# Altium schematic sheet Структурная.SchDoc
size 840 x 594 mm; Address1: Address1; Address2: Address2; Address3: Address3; Address4: Address4; SheetNumber: 1; Scale: 1:1; Разраб.: Иванов; Обозначение документа: АБВГ.123456.001 Э3; Пров.: Петров; Утв.: Сидоров; Наименование организации: ОАО "Концерн "МПО-Гидроприбор"; Перв. применение: АБВГ.123456.000; Наименование изделия 1: Плата; Наименование изделия 2: Схема электрическая; Наименование изделия 3: принципиальная; Нач. отд.: Нач. отд.; Фамилия нач. отд.: Сидоров
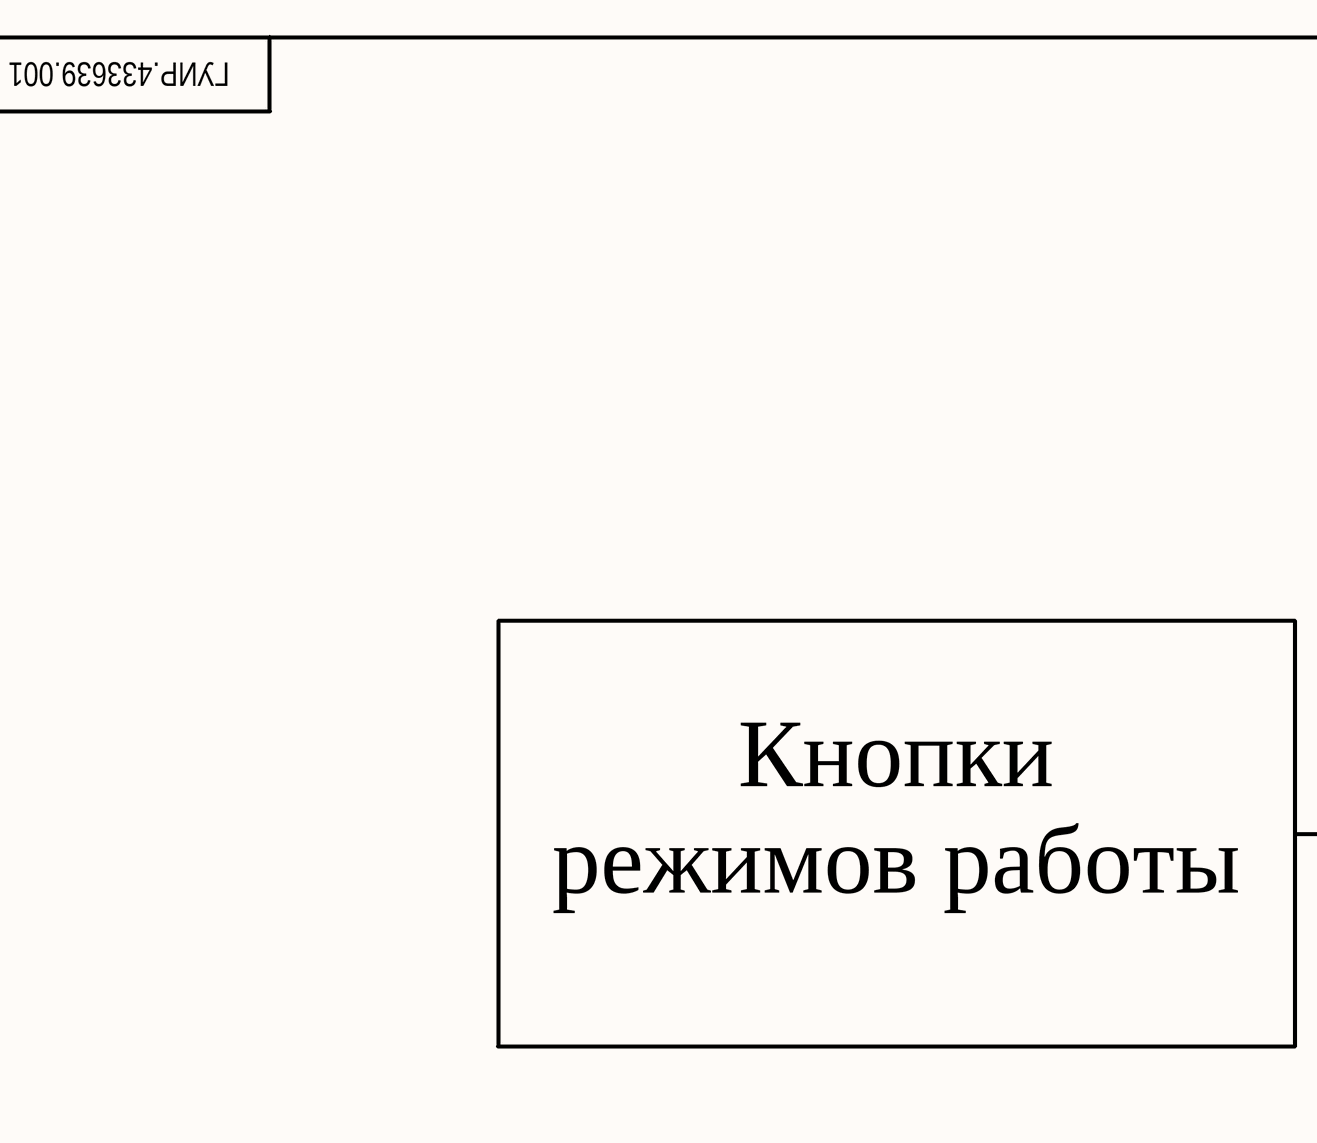
[diagram p0: Структурная.SchDoc, top left]
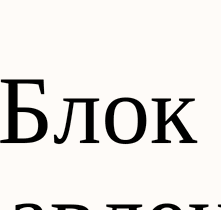
[diagram p1: Структурная.SchDoc, top middle]
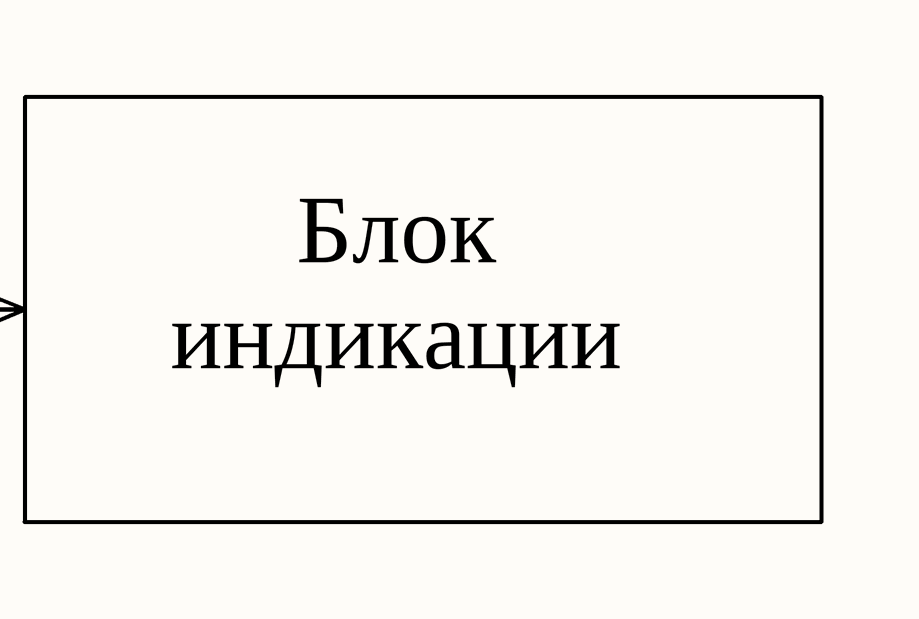
[diagram p2: Структурная.SchDoc, top right]
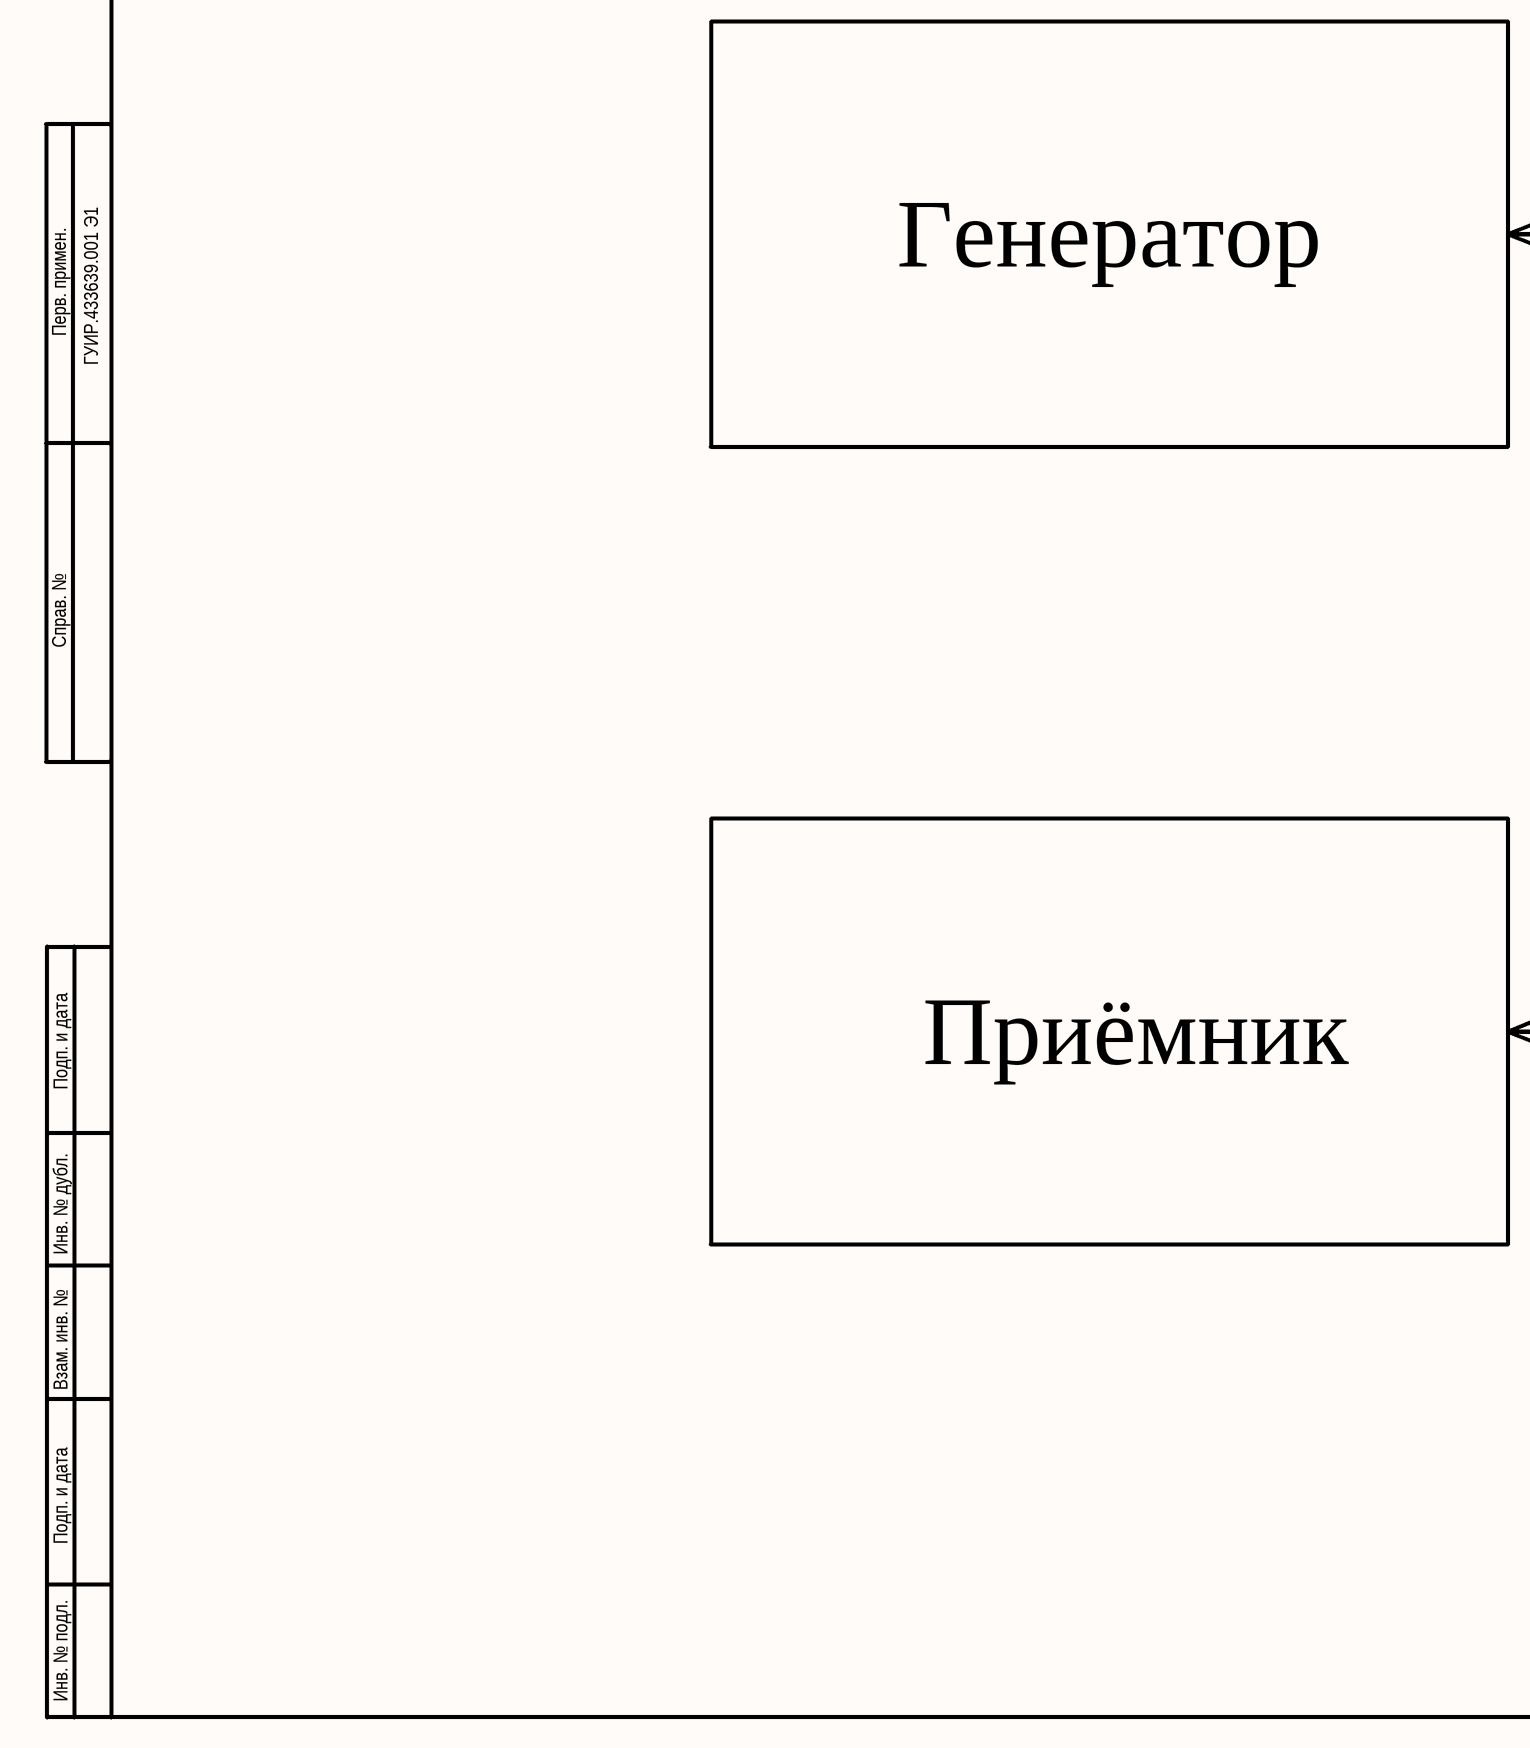
[diagram p3: Структурная.SchDoc, bottom left]
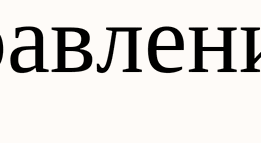
[diagram p4: Структурная.SchDoc, bottom middle]
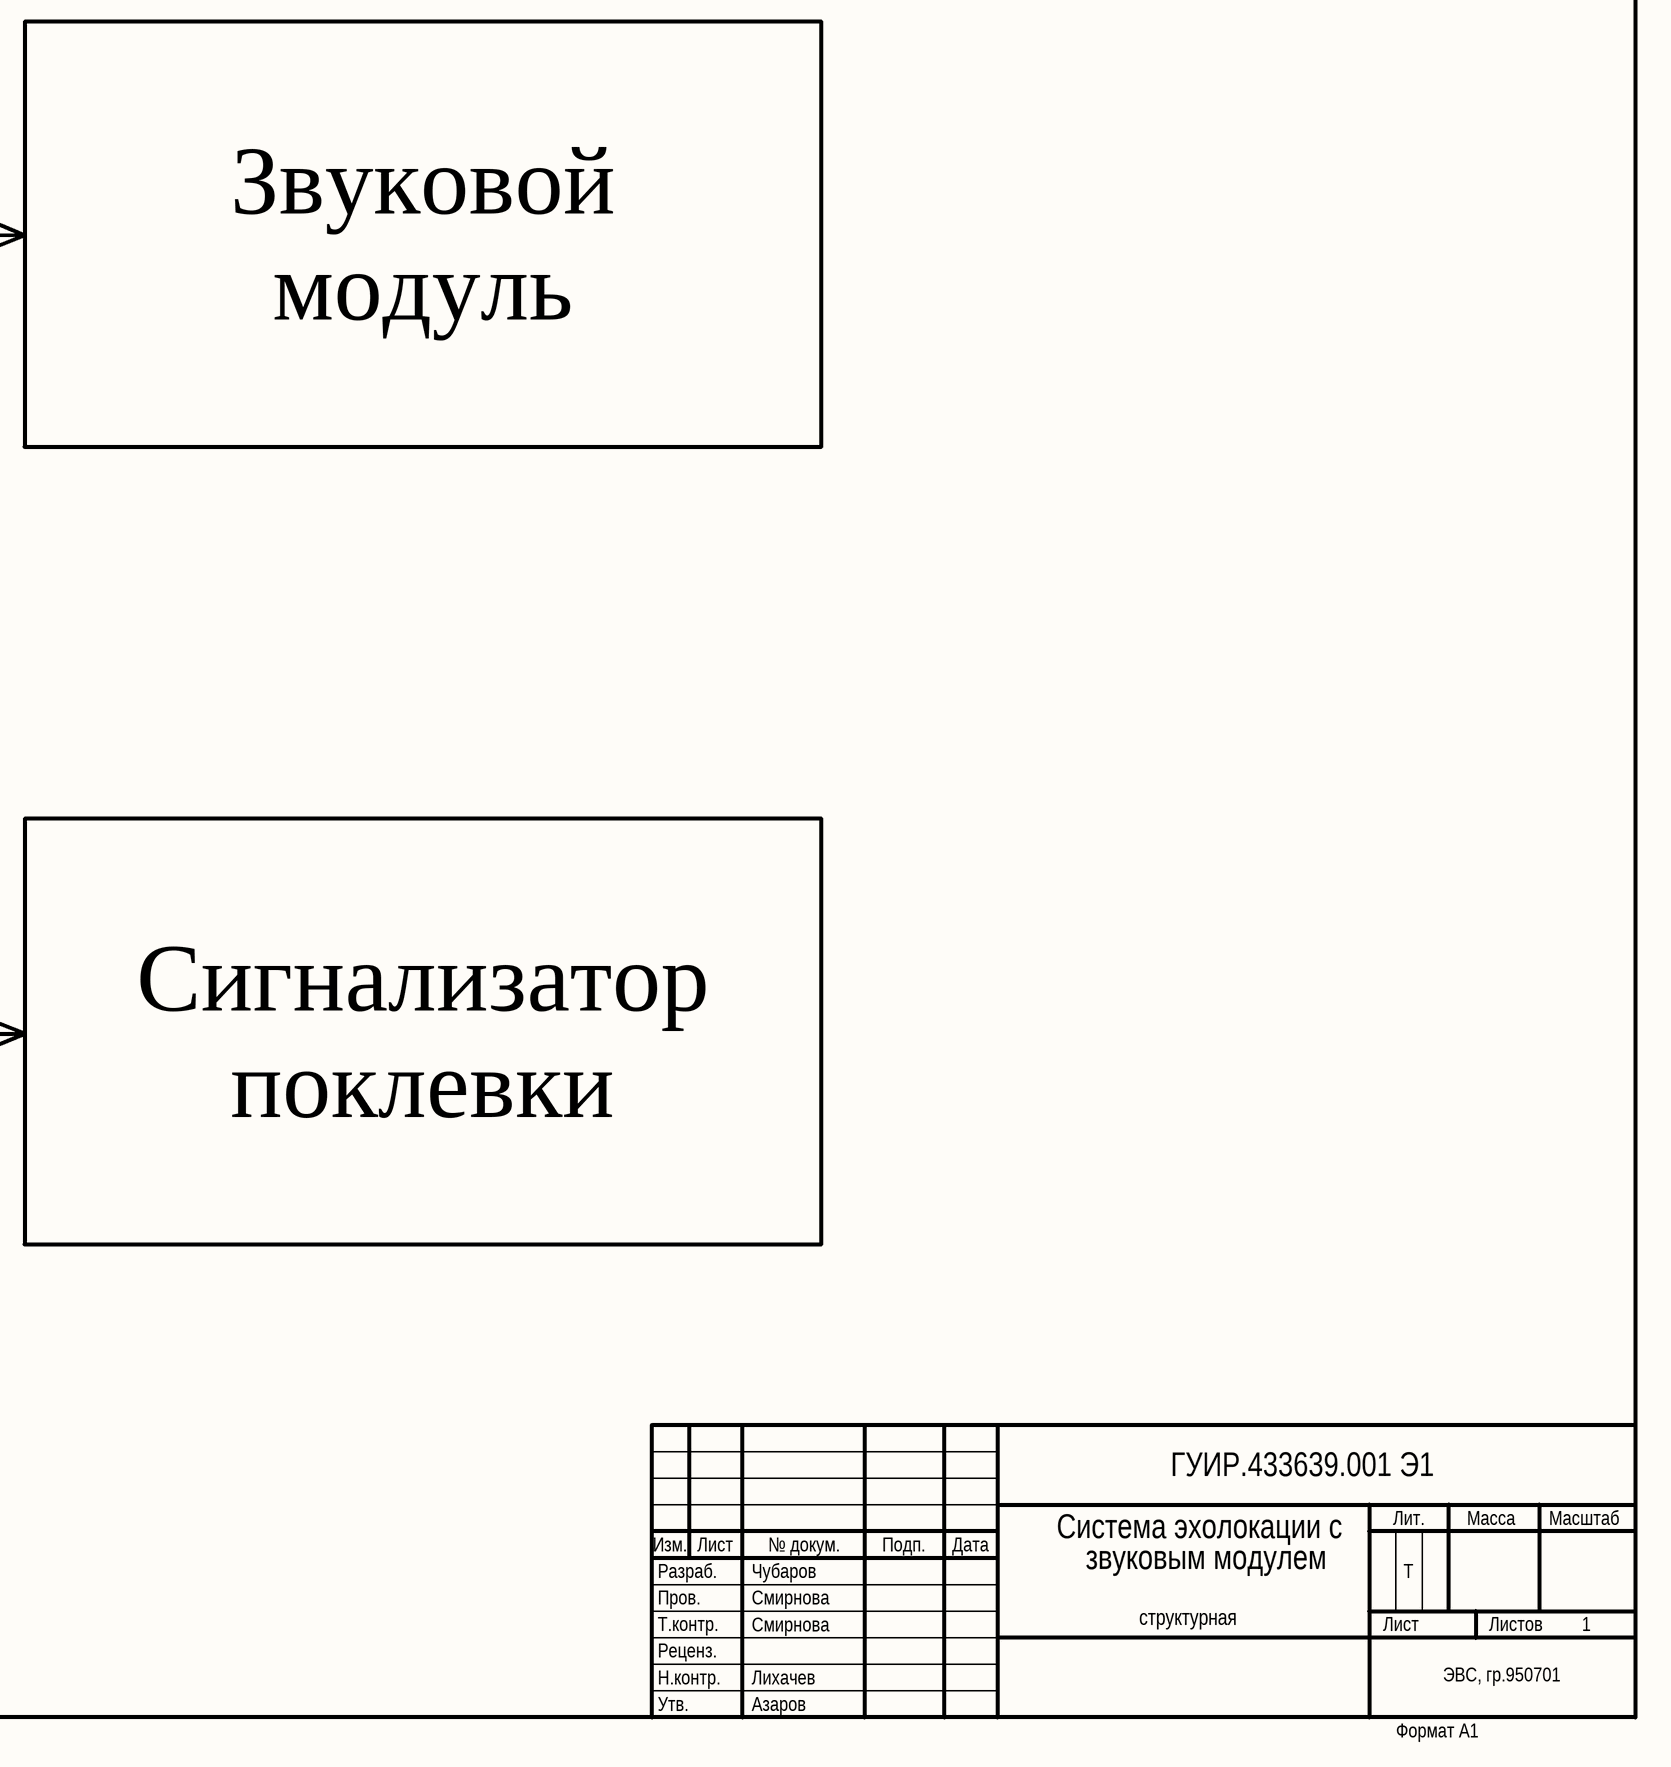
[diagram p5: Структурная.SchDoc, bottom right]

## Notes on the sheet
- ГУИР.433639.001 Э1
- Кнопки
- Блок
- режимов работы
- индикации
- управления
- Звуковой
- Генератор
- модуль
- Перв. примен.
- Справ. №
- Приёмник
- Сигнализатор
- Подп. и дата
- поклевки
- Инв. № дубл.
- Взам. инв. №
- Разраб.
- Изм.
- Лист
- Чубаров
- № докум.
- Подп.
- Дата
- Система эхолокации с
- звуковым модулем
- Т
- Лит.
- Масса
- Масштаб
- Пров.
- Т.контр.
- Смирнова
- структурная
- Листов
- 1
- Инв. № подл.
- Утв.
- Н.контр.
- Реценз.
- Лихачев
- Азаров
- ЭВС, гр.950701
- Формат А1